# EAGLE schematic Controller (EAGLE 7.7.0)

## Sheet 1 of 2
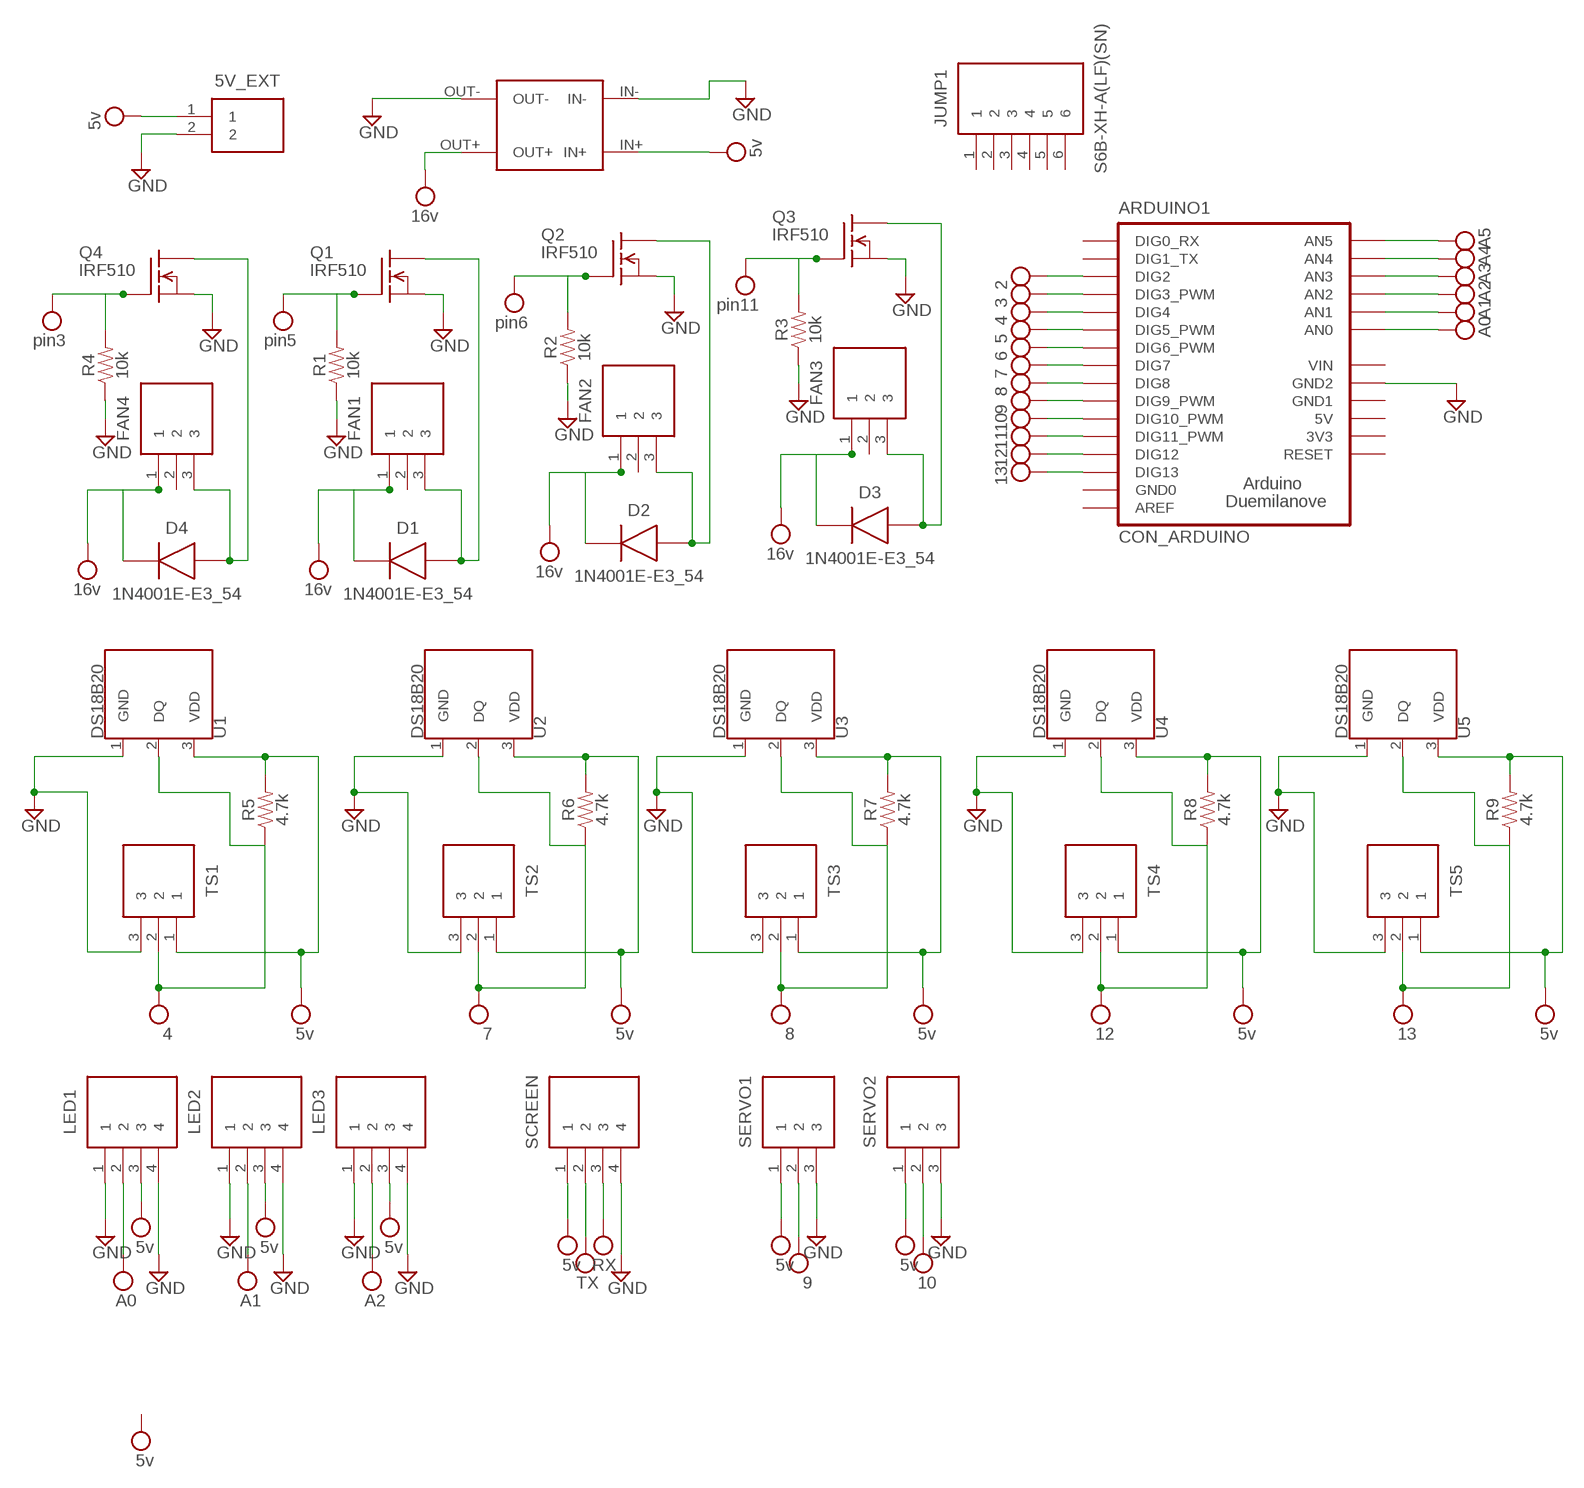
[diagram p0: schematic, sheet 1]

### Parts
5V_EXT  S2B-XH-A(LF)(SN)  [SHDR2W80P0X250_1X2_740X575X700]
ARDUINO1  CON_ARDUINO  [CON_ARDUINO]
D1  1N4001E-E3_54  [DIOAD1405W86L465D235]
D2  1N4001E-E3_54  [DIOAD1405W86L465D235]
D3  1N4001E-E3_54  [DIOAD1405W86L465D235]
D4  1N4001E-E3_54  [DIOAD1405W86L465D235]
FAN1  S3B-XH-A(LF)(SN)  [SHDR3W80P0X250_1X3_990X610X700]
FAN2  S3B-XH-A(LF)(SN)  [SHDR3W80P0X250_1X3_990X610X700]
FAN3  S3B-XH-A(LF)(SN)  [SHDR3W80P0X250_1X3_990X610X700]
FAN4  S3B-XH-A(LF)(SN)  [SHDR3W80P0X250_1X3_990X610X700]
JUMP1  S6B-XH-A(LF)(SN)  [SHDR6W64P0X250_1X6_1740X1155X7]
LED1  S4B-XH-A(LF)(SN)  [SHDR4W64P0X250_1X4_1240X1155X7]
LED2  S4B-XH-A(LF)(SN)  [SHDR4W64P0X250_1X4_1240X1155X7]
LED3  S4B-XH-A(LF)(SN)  [SHDR4W64P0X250_1X4_1240X1155X7]
Q1  IRF510  [TO220]
Q2  IRF510  [TO220]
Q3  IRF510  [TO220]
Q4  IRF510  [TO220]
R1  10k  10KOHM-HORIZ-1/4W-5%  [AXIAL-0.3]
R2  10k  10KOHM-HORIZ-1/4W-5%  [AXIAL-0.3]
R3  10k  10KOHM-HORIZ-1/4W-5%  [AXIAL-0.3]
R4  10k  10KOHM-HORIZ-1/4W-5%  [AXIAL-0.3]
R5  4.7k  10KOHM-HORIZ-1/4W-5%  [AXIAL-0.3]
R6  4.7k  10KOHM-HORIZ-1/4W-5%  [AXIAL-0.3]
R7  4.7k  10KOHM-HORIZ-1/4W-5%  [AXIAL-0.3]
R8  4.7k  10KOHM-HORIZ-1/4W-5%  [AXIAL-0.3]
R9  4.7k  10KOHM-HORIZ-1/4W-5%  [AXIAL-0.3]
SCREEN  S4B-XH-A(LF)(SN)  [SHDR4W64P0X250_1X4_1240X1155X7]
SERVO1  S3B-XH-A(LF)(SN)  [SHDR3W80P0X250_1X3_990X610X700]
SERVO2  S3B-XH-A(LF)(SN)  [SHDR3W80P0X250_1X3_990X610X700]
TS1  S3B-XH-A(LF)(SN)  [SHDR3W80P0X250_1X3_990X610X700]
TS2  S3B-XH-A(LF)(SN)  [SHDR3W80P0X250_1X3_990X610X700]
TS3  S3B-XH-A(LF)(SN)  [SHDR3W80P0X250_1X3_990X610X700]
TS4  S3B-XH-A(LF)(SN)  [SHDR3W80P0X250_1X3_990X610X700]
TS5  S3B-XH-A(LF)(SN)  [SHDR3W80P0X250_1X3_990X610X700]
U1  DS18B20  [TO-92-AMMO]
U2  DS18B20  [TO-92-AMMO]
U3  DS18B20  [TO-92-AMMO]
U4  DS18B20  [TO-92-AMMO]
U5  DS18B20  [TO-92-AMMO]
U$1  CN6009THROUGH_HOLE  [CN6009]

### Nets
5V_EXT: 5V_EXT.1 LED1.3 LED2.3 LED3.3 R5.P$2 R6.P$2 R7.P$2 R8.P$2 R9.P$2 SCREEN.1 SERVO1.1 SERVO2.1 TS1.1 TS2.1 TS3.1 TS4.1 TS5.1 U1.3(VDD) U2.3(VDD) U3.3(VDD) U4.3(VDD) U5.3(VDD) U$1.IN+ ; supply symbol labelled 5v ; also sheet 2
16V: D1.2(K) D2.2(K) D3.2(K) D4.2(K) FAN1.1 FAN2.1 FAN3.1 FAN4.1 U$1.OUT+ ; supply symbol labelled 16v ; also sheet 2
GND: 5V_EXT.2 ARDUINO1.GND2 LED1.1 LED1.4 LED2.1 LED2.4 LED3.1 LED3.4 Q1.3(S) Q2.3(S) Q3.3(S) Q4.3(S) R1.P$1 R2.P$1 R3.P$1 R4.P$1 SCREEN.4 SERVO1.3 SERVO2.3 TS1.3 TS2.3 TS3.3 TS4.3 TS5.3 U1.1(GND) U2.1(GND) U3.1(GND) U4.1(GND) U5.1(GND) U$1.IN- U$1.OUT- ; also sheet 2
N$1: D2.1(A) FAN2.3 Q2.2(D)
N$2: D3.1(A) FAN3.3 Q3.2(D)
N$3: D1.1(A) FAN1.3 Q1.2(D)
N$4: D4.1(A) FAN4.3 Q4.2(D)
PIN2: ARDUINO1.D_2(DIG2) ; supply symbol labelled 2
PIN3: ARDUINO1.D_3(DIG3_PWM) Q4.1(G) R4.P$2 ; supply symbol labelled pin3, 3 ; also sheet 2
PIN4: ARDUINO1.D_4(DIG4) R5.P$1 TS1.2 U1.2(DQ) ; supply symbol labelled 4
PIN5: ARDUINO1.D_5(DIG5_PWM) Q1.1(G) R1.P$2 ; supply symbol labelled pin5, 5 ; also sheet 2
PIN6: ARDUINO1.D_6(DIG6_PWM) Q2.1(G) R2.P$2 ; supply symbol labelled pin6, 6 ; also sheet 2
PIN7: ARDUINO1.D_7(DIG7) R6.P$1 TS2.2 U2.2(DQ) ; supply symbol labelled 7
PIN8: ARDUINO1.D_8(DIG8) R7.P$1 TS3.2 U3.2(DQ) ; supply symbol labelled 8
PIN9: ARDUINO1.D_9(DIG9_PWM) SERVO1.2 ; supply symbol labelled 9
PIN10: ARDUINO1.D_10(DIG10_PWM) SERVO2.2 ; supply symbol labelled 10
PIN11: ARDUINO1.D_11(DIG11_PWM) Q3.1(G) R3.P$2 ; supply symbol labelled pin11, 11 ; also sheet 2
PIN12: ARDUINO1.D_12(DIG12) R8.P$1 TS4.2 U4.2(DQ) ; supply symbol labelled 12
PIN13: ARDUINO1.D_13(DIG13) R9.P$1 TS5.2 U5.2(DQ) ; supply symbol labelled 13
PIN_A0: ARDUINO1.A_0(AN0) LED1.2 ; supply symbol labelled A0
PIN_A1: ARDUINO1.A_1(AN1) LED2.2 ; supply symbol labelled A1
PIN_A2: ARDUINO1.A_2(AN2) LED3.2 ; supply symbol labelled A2
PIN_A3: ARDUINO1.A_3(AN3) SCREEN.2 ; supply symbol labelled A3, TX
PIN_A4: ARDUINO1.A_4(AN4) SCREEN.3 ; supply symbol labelled A4, RX
PIN_A5: ARDUINO1.A_5(AN5) ; supply symbol labelled A5
Unconnected: ARDUINO1.3V3 ARDUINO1.5V ARDUINO1.AREF ARDUINO1.D_0(DIG0_RX) ARDUINO1.D_1(DIG1_TX) ARDUINO1.GND0 ARDUINO1.GND1 ARDUINO1.RESET FAN1.2 FAN2.2 FAN3.2 FAN4.2 JUMP1.1 JUMP1.2 JUMP1.3 JUMP1.4 JUMP1.5 JUMP1.6

## Sheet 2 of 2: Fan controller board
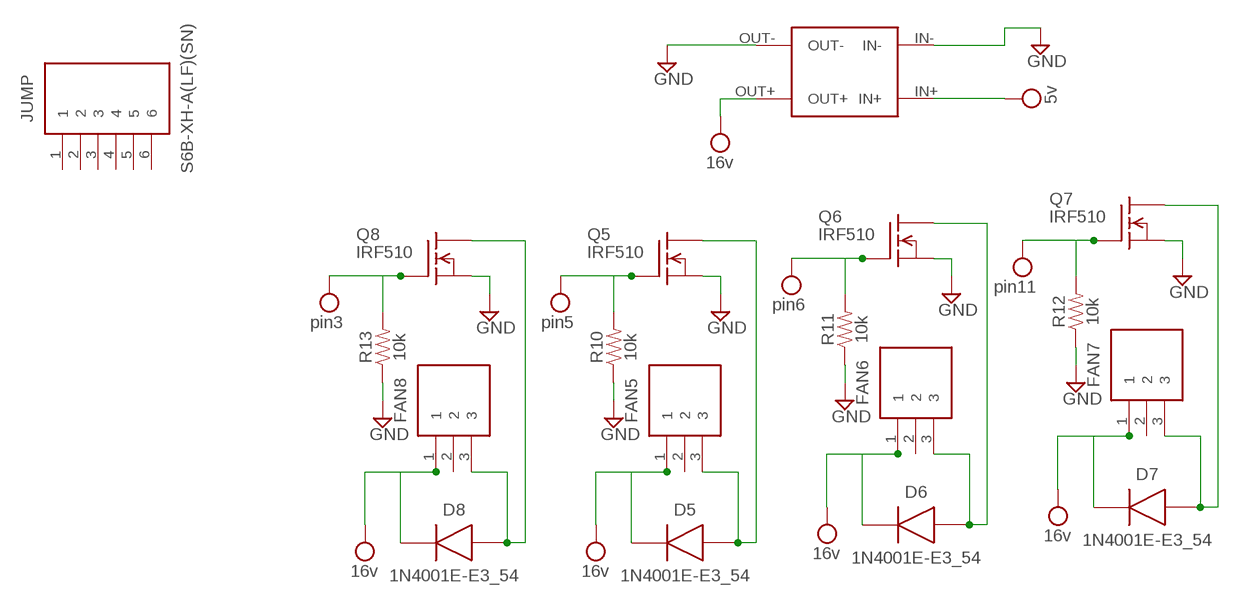
[diagram p1: schematic, sheet 2]

### Parts
D5  1N4001E-E3_54  [DIOAD1405W86L465D235]
D6  1N4001E-E3_54  [DIOAD1405W86L465D235]
D7  1N4001E-E3_54  [DIOAD1405W86L465D235]
D8  1N4001E-E3_54  [DIOAD1405W86L465D235]
FAN5  S3B-XH-A(LF)(SN)  [SHDR3W80P0X250_1X3_990X610X700]
FAN6  S3B-XH-A(LF)(SN)  [SHDR3W80P0X250_1X3_990X610X700]
FAN7  S3B-XH-A(LF)(SN)  [SHDR3W80P0X250_1X3_990X610X700]
FAN8  S3B-XH-A(LF)(SN)  [SHDR3W80P0X250_1X3_990X610X700]
JUMP  S6B-XH-A(LF)(SN)  [SHDR6W64P0X250_1X6_1740X1155X7]
Q5  IRF510  [TO220]
Q6  IRF510  [TO220]
Q7  IRF510  [TO220]
Q8  IRF510  [TO220]
R10  10k  10KOHM-HORIZ-1/4W-5%  [AXIAL-0.3]
R11  10k  10KOHM-HORIZ-1/4W-5%  [AXIAL-0.3]
R12  10k  10KOHM-HORIZ-1/4W-5%  [AXIAL-0.3]
R13  10k  10KOHM-HORIZ-1/4W-5%  [AXIAL-0.3]
U$2  CN6009THROUGH_HOLE  [CN6009]

### Nets
5V_EXT: U$2.IN+ ; supply symbol labelled 5v ; also sheet 1
16V: D5.2(K) D6.2(K) D7.2(K) D8.2(K) FAN5.1 FAN6.1 FAN7.1 FAN8.1 U$2.OUT+ ; supply symbol labelled 16v ; also sheet 1
GND: Q5.3(S) Q6.3(S) Q7.3(S) Q8.3(S) R10.P$1 R11.P$1 R12.P$1 R13.P$1 U$2.IN- U$2.OUT- ; also sheet 1
N$5: D5.1(A) FAN5.3 Q5.2(D)
N$6: D6.1(A) FAN6.3 Q6.2(D)
N$7: D7.1(A) FAN7.3 Q7.2(D)
N$8: D8.1(A) FAN8.3 Q8.2(D)
PIN3: Q8.1(G) R13.P$2 ; supply symbol labelled pin3 ; also sheet 1
PIN5: Q5.1(G) R10.P$2 ; supply symbol labelled pin5 ; also sheet 1
PIN6: Q6.1(G) R11.P$2 ; supply symbol labelled pin6 ; also sheet 1
PIN11: Q7.1(G) R12.P$2 ; supply symbol labelled pin11 ; also sheet 1
Unconnected: FAN5.2 FAN6.2 FAN7.2 FAN8.2 JUMP.1 JUMP.2 JUMP.3 JUMP.4 JUMP.5 JUMP.6

## Power pins joined to a net without a drawn wire
VIN: ARDUINO1.VIN

## Library data of the parts
5V_EXT = SamacSys_Parts:S2B-XH-A(LF)(SN): XH-2.5mm Header side entry 2 way JST XH Series, Series Number S2B, 2.5mm Pitch 2 Way 1 Row Right Angle PCB Header, Solder Termination, 3A <https://componentsearchengine.com/Images/3/S2B-XH-A%28LF%29%28SN%29.jpg> Source: Datasheet <http://www.jst-mfg.com/product/pdf/eng/eXH.pdf>; DESCRIPTION: XH-2.5mm Header side entry 2 way JST XH Series, Series Number S2B, 2.5mm Pitch 2 Way 1 Row Right Angle PCB Header, Solder Termination, 3A; HEIGHT: 7mm; MANUFACTURER_NAME: JST (JAPAN SOLDERLESS TERMINALS); MANUFACTURER_PART_NUMBER: S2B-XH-A(LF)(SN); RS_PART_NUMBER: 8201582; SUPPLIER_NAME: RS
ARDUINO1 = dp_devices.v6:CON_ARDUINO: Arduino board connector layout
D1-D8 = SamacSys_Parts:1N4001E-E3_54: Rectifiers Vr/50V Io/1A <https://componentsearchengine.com/Images/1/1N4001E-E3_54.jpg> Source: Datasheet <http://www.vishay.com/docs/88503/1n4001.pdf>; DESCRIPTION: Rectifiers Vr/50V Io/1A; HEIGHT: mm; MANUFACTURER_NAME: Vishay; MANUFACTURER_PART_NUMBER: 1N4001E-E3/54; SUPPLIER_NAME: RS
FAN1-FAN8 SERVO1 SERVO2 TS1-TS5 = SamacSys_Parts:S3B-XH-A(LF)(SN): XH-2.5mm Header side entry 3 way JST XH Series, Series Number S3B, 2.5mm Pitch 3 Way 1 Row Right Angle PCB Header, Solder Termination, 3A <https://componentsearchengine.com/Images/3/S3B-XH-A%28LF%29%28SN%29.jpg> Source: Datasheet <http://www.jst-mfg.com/product/pdf/eng/eXH.pdf>; DESCRIPTION: XH-2.5mm Header side entry 3 way JST XH Series, Series Number S3B, 2.5mm Pitch 3 Way 1 Row Right Angle PCB Header, Solder Termination, 3A; HEIGHT: 7mm; MANUFACTURER_NAME: JST (JAPAN SOLDERLESS TERMINALS); MANUFACTURER_PART_NUMBER: S3B-XH-A(LF)(SN); RS_PART_NUMBER: 8201585; SUPPLIER_NAME: RS
JUMP JUMP1 = SamacSys_Parts:S6B-XH-A(LF)(SN): XH-2.5mm Header side entry 6 way JST XH Series, Series Number S6B, 2.5mm Pitch 6 Way 1 Row Right Angle PCB Header, Solder Termination, 3A <https://componentsearchengine.com/Images/3/S6B-XH-A%28LF%29%28SN%29.jpg> Source: Datasheet <http://www.jst-mfg.com/product/pdf/eng/eXH.pdf>; DESCRIPTION: XH-2.5mm Header side entry 6 way JST XH Series, Series Number S6B, 2.5mm Pitch 6 Way 1 Row Right Angle PCB Header, Solder Termination, 3A; HEIGHT: 7mm; MANUFACTURER_NAME: JST (JAPAN SOLDERLESS TERMINALS); MANUFACTURER_PART_NUMBER: S6B-XH-A(LF)(SN); RS_PART_NUMBER: 8201591; SUPPLIER_NAME: RS
LED1-LED3 SCREEN = SamacSys_Parts:S4B-XH-A(LF)(SN): XH-2.5mm Header side entry 4 way JST XH Series, Series Number S4B, 2.5mm Pitch 4 Way 1 Row Right Angle PCB Header, Solder Termination, 3A <https://componentsearchengine.com/Images/3/S4B-XH-A%28LF%29%28SN%29.jpg> Source: Datasheet <http://www.jst-mfg.com/product/pdf/eng/eXH.pdf>; DESCRIPTION: XH-2.5mm Header side entry 4 way JST XH Series, Series Number S4B, 2.5mm Pitch 4 Way 1 Row Right Angle PCB Header, Solder Termination, 3A; HEIGHT: 7mm; MANUFACTURER_NAME: JST (JAPAN SOLDERLESS TERMINALS); MANUFACTURER_PART_NUMBER: S4B-XH-A(LF)(SN); RS_PART_NUMBER: 8201589; SUPPLIER_NAME: RS
Q1-Q8 = transistor-fet:IRF510: N-Channel Enhancement MOSFET (HEXFET); 100V; 5,6A; 0,54Ohm
R1-R4 R10-R13 = SparkFun-Resistors:10KOHM: 10kΩ resistor A resistor is a passive two-terminal electrical component that implements electrical resistance as a circuit element. Resistors act to reduce current flow, and, at the same time, act to lower voltage levels within circuits. - Wikipedia; PROD_ID: RES-09435
R5-R9 = SparkFun-Resistors:10KOHM: 10kΩ resistor A resistor is a passive two-terminal electrical component that implements electrical resistance as a circuit element. Resistors act to reduce current flow, and, at the same time, act to lower voltage levels within circuits. - Wikipedia; PROD_ID: RES-09435; VALUE: 10k
U1-U5 = SparkFun-Sensors:DS18B20: Dallas/Maxim DS18B20 1-Wire Temperature Sensor The DS18B20 reports degrees C with 9 to 12-bit precision, -55C to 125C (+/-0.5C). Each sensor has a unique 64-Bit Serial number etched into it - allows for a huge number of sensors to be used on one data bus. Datasheet <http://datasheets.maximintegrated.com/en/ds/DS18B20.pdf> SparkFun Products One Wire Digital Temperature Sensor - DS18B20 <https://www.sparkfun.com/products/245> (SEN-00245); STORE_ID: SEN-00245
U$1 U$2 = CN6009:CN6009